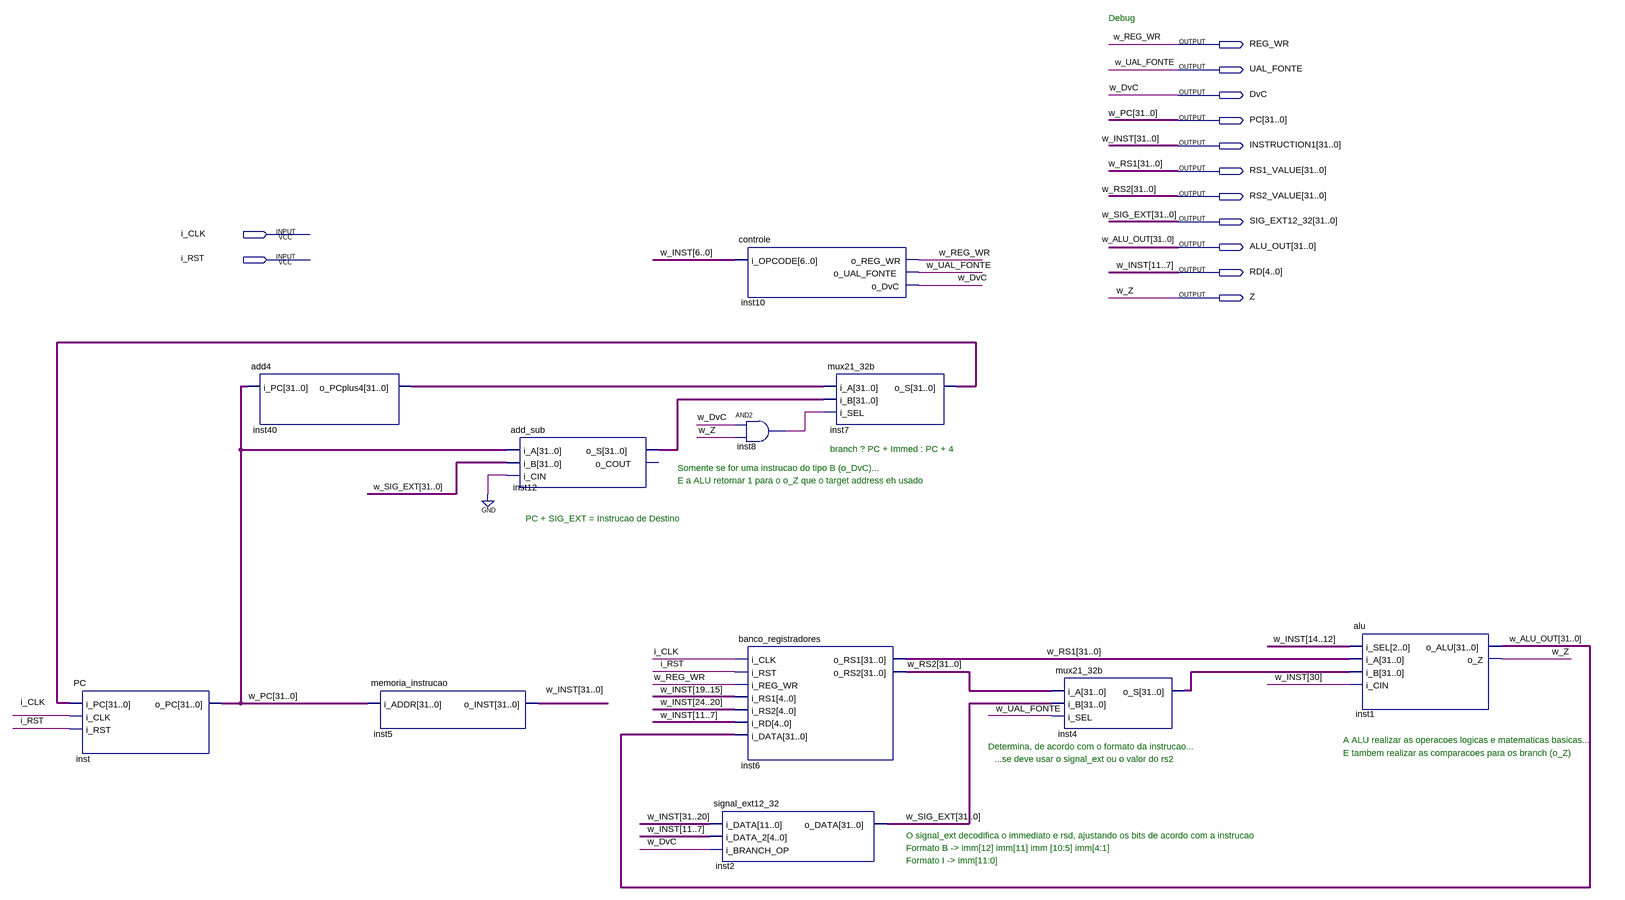
[diagram p0: schematic sheet]
// Quartus schematic risc_v32i.bdf as structural Verilog: 11 symbols, 13 pins
module risc_v32i (
  input  i_CLK,
  input  i_RST,
  output REG_WR,
  output UAL_FONTE,
  output DvC,
  output [31:0] PC,
  output [31:0] INSTRUCTION1,
  output [31:0] RS1_VALUE,
  output [31:0] RS2_VALUE,
  output [31:0] SIG_EXT12_32,
  output [31:0] ALU_OUT,
  output [4:0] RD,
  output Z
);

  wire inst8_out;
  wire [31:0] inst4_o_s, inst7_o_s, inst12_o_s, inst40_o_pcplus4;

  PC inst (.i_PC(inst7_o_s), .i_CLK(i_CLK), .i_RST(i_RST), .o_PC(PC));
  add4 inst40 (.i_PC(PC), .o_PCplus4(inst40_o_pcplus4));
  memoria_instrucao inst5 (.i_ADDR(PC), .o_INST(INSTRUCTION1));
  add_sub inst12 (.i_A(PC), .i_B(SIG_EXT12_32), .i_CIN(1'b0), .o_S(inst12_o_s));  // open: o_COUT
  controle inst10 (.i_OPCODE(INSTRUCTION1[6:0]), .o_REG_WR(REG_WR), .o_UAL_FONTE(UAL_FONTE), .o_DvC(DvC));
  and inst8 (inst8_out, DvC, Z);
  banco_registradores inst6 (
    .i_CLK(i_CLK), .i_RST(i_RST), .i_REG_WR(REG_WR), .i_RS1(INSTRUCTION1[19:15]),
    .i_RS2(INSTRUCTION1[24:20]), .i_RD(INSTRUCTION1[11:7]), .i_DATA(ALU_OUT), .o_RS1(RS1_VALUE),
    .o_RS2(RS2_VALUE));
  signal_ext12_32 inst2 (
    .i_DATA(INSTRUCTION1[31:20]), .i_DATA_2(INSTRUCTION1[11:7]), .i_BRANCH_OP(DvC), .o_DATA(SIG_EXT12_32));
  mux21_32b inst7 (.i_A(inst40_o_pcplus4), .i_B(inst12_o_s), .i_SEL(inst8_out), .o_S(inst7_o_s));
  mux21_32b inst4 (.i_A(RS2_VALUE), .i_B(SIG_EXT12_32), .i_SEL(UAL_FONTE), .o_S(inst4_o_s));
  alu inst1 (
    .i_SEL(INSTRUCTION1[14:12]), .i_A(RS1_VALUE), .i_B(inst4_o_s), .i_CIN(INSTRUCTION1[30]), .o_ALU(ALU_OUT),
    .o_Z(Z));

  assign RD = INSTRUCTION1[11:7];

  // Other names for the same wires on the sheet: w_ALU_OUT[31:0] = ALU_OUT; w_DvC = DvC; w_INST[31:0] = INSTRUCTION1;
  //   w_PC[31:0] = PC; w_REG_WR = REG_WR; w_RS1[31:0] = RS1_VALUE; w_RS2[31:0] = RS2_VALUE;
  //   w_SIG_EXT[31:0] = SIG_EXT12_32; w_UAL_FONTE = UAL_FONTE; w_Z = Z

  // Notes on the sheet:
  //   Debug
  //   branch ? PC + Immed : PC + 4
  //   Somente se for uma instrucao do tipo B (o_DvC)...
  //   E a ALU retornar 1 para o o_Z que o target address eh usado
  //   PC + SIG_EXT = Instrucao de Destino
  //   A ALU realizar as operacoes logicas e matematicas basicas...
  //   Determina, de acordo com o formato da instrucao...
  //   E tambem realizar as comparacoes para os branch (o_Z)
  //   ...se deve usar o signal_ext ou o valor do rs2
  //   O signal_ext decodifica o immediato e rsd, ajustando os bits de acordo com a instrucao
  //   Formato B -> imm[12] imm[11] imm [10:5] imm[4:1]
  //   Formato I -> imm[11:0]
endmodule
